# EasyEDA schematic P2000Cartridge-schem.json
TITLE: P2000 Multi ROM Cartridge; REV: 1.0; Date: 2026-02-09; Sheet: 1/1; Drawn By: Maarten Pennings; Company: Erix Collectables
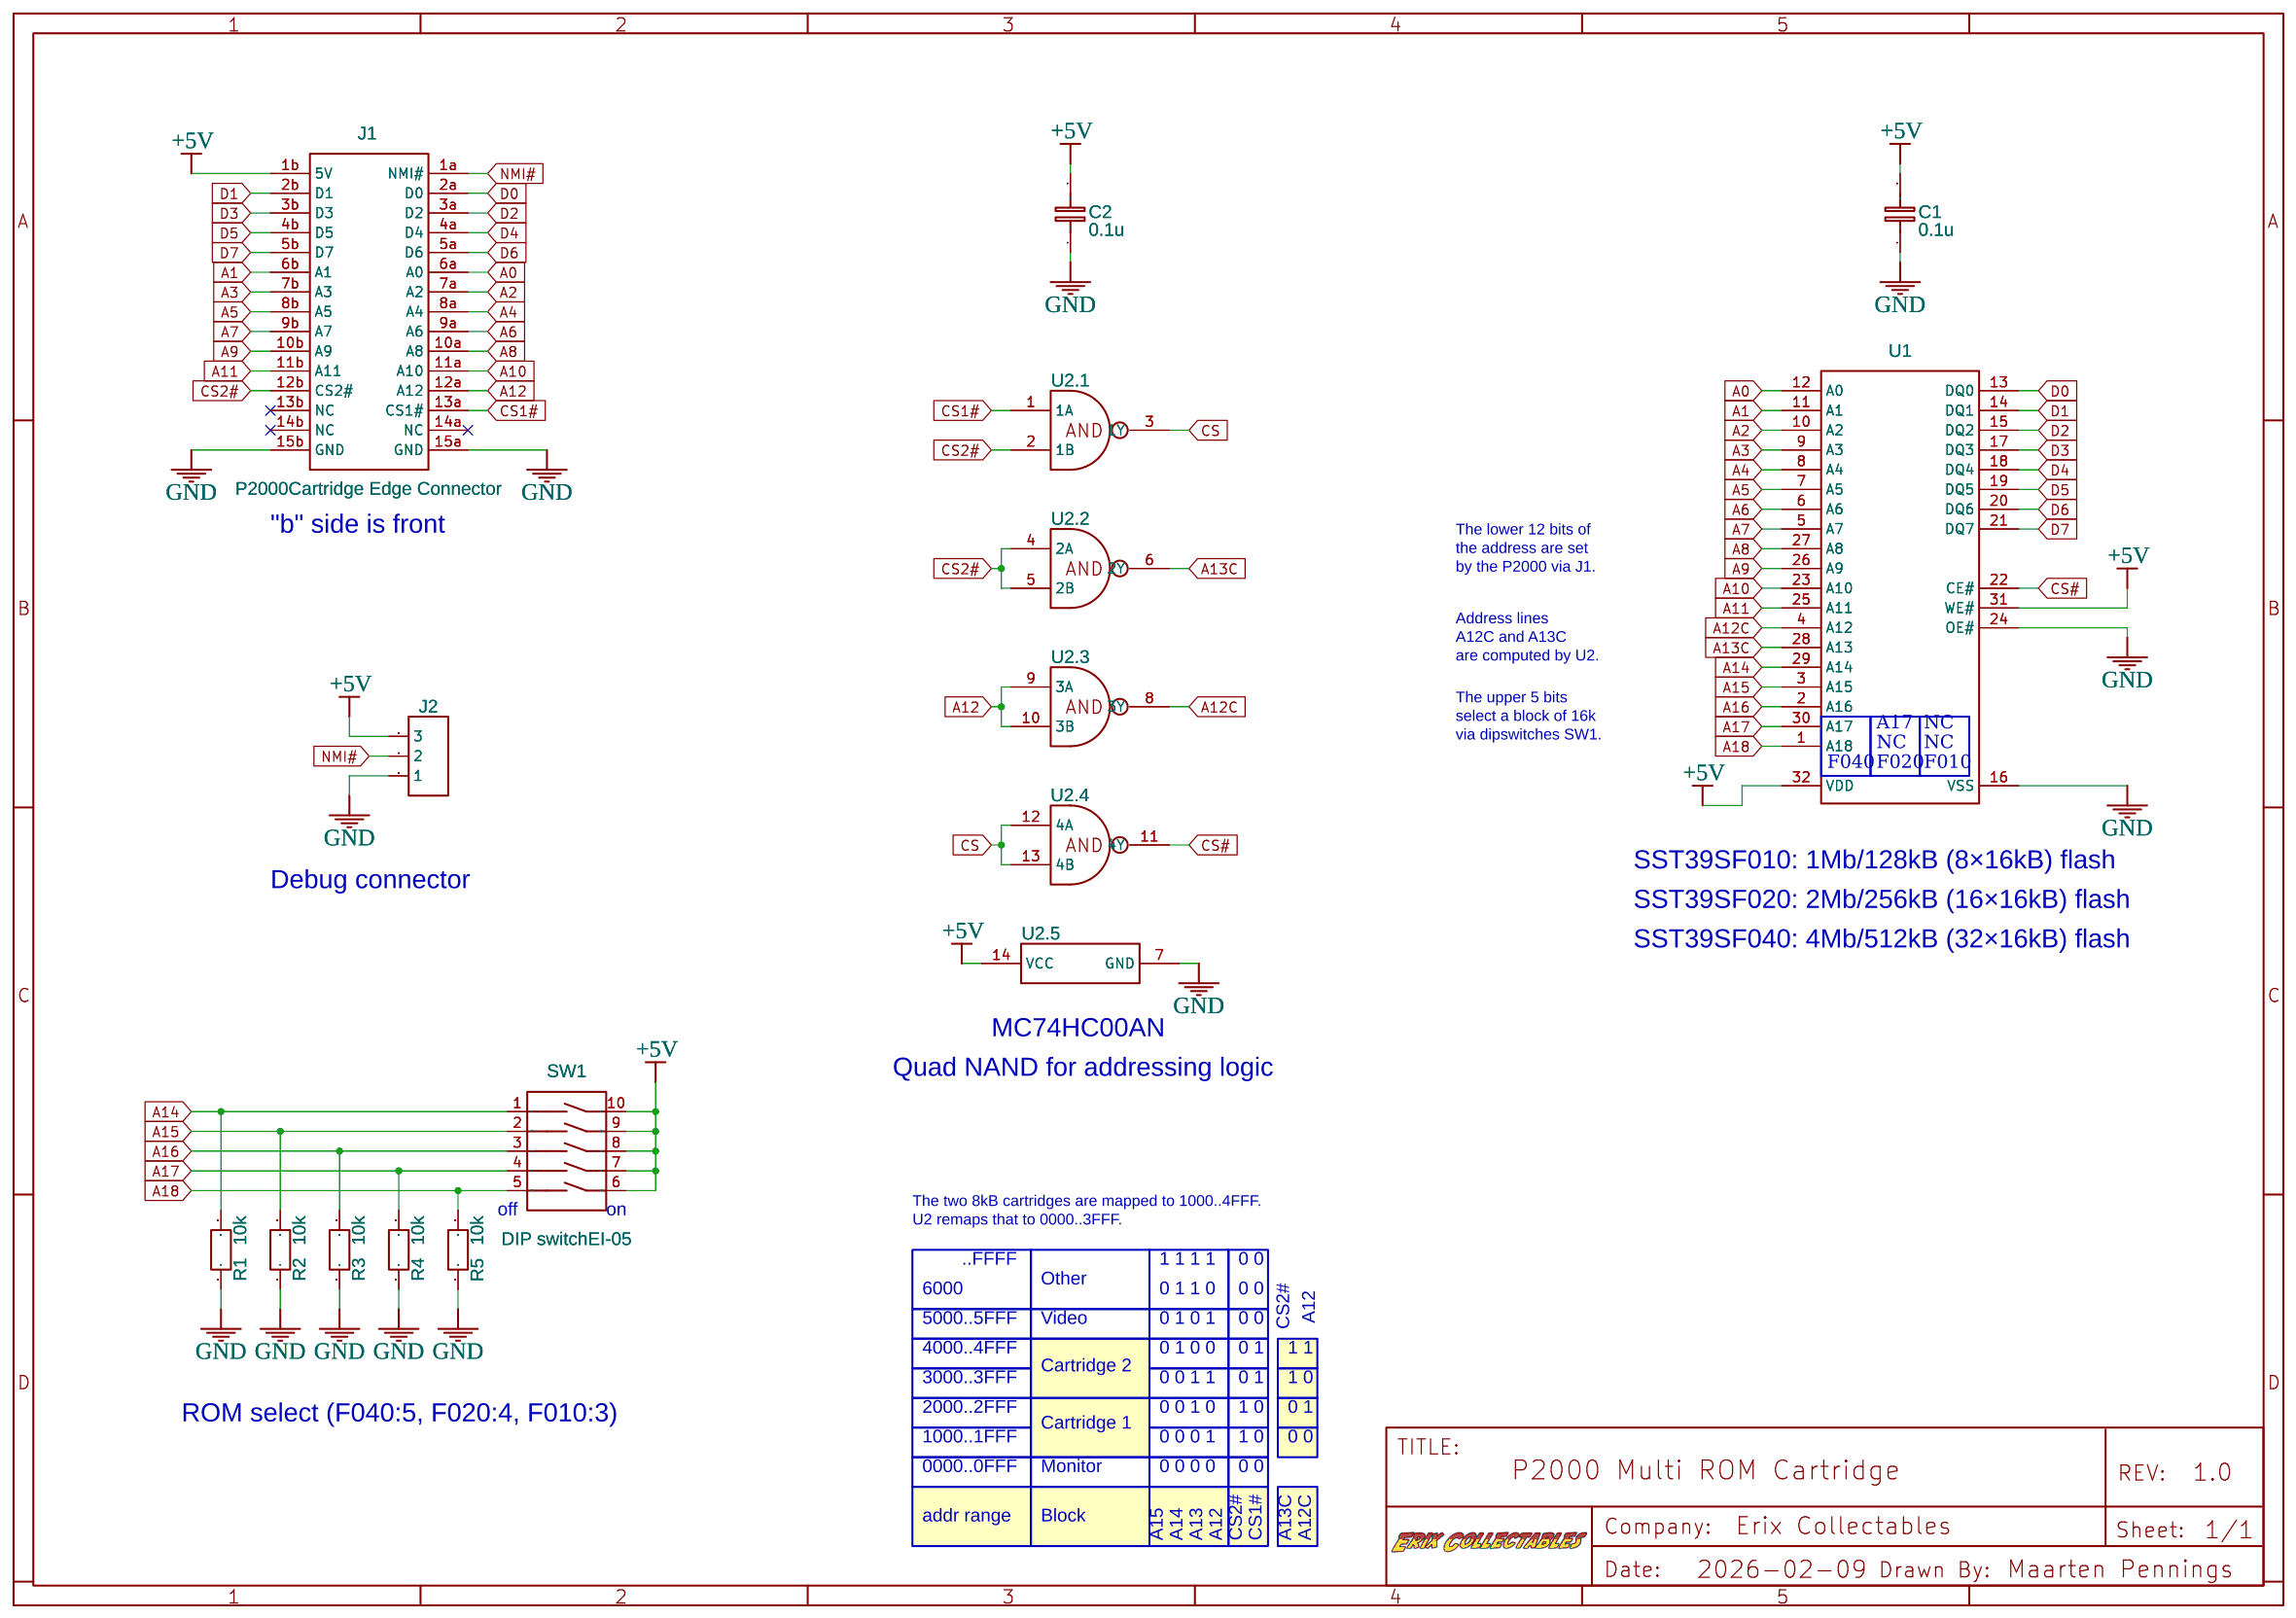
[diagram p0: schematic sheet]

## Parts
C1  0.1u  [RAD-0.1]
C2  0.1u  [RAD-0.1]
J1  P2000Cartridge Edge Connector  [P2000 CARTRIDGE EDGE CONNECTOR]
J2  HDR-M-2.54_1x3  [HDR-M-2.54_1X3]
R1  10k  [R_AXIAL-0.4]
R2  10k  [R_AXIAL-0.4]
R3  10k  [R_AXIAL-0.4]
R4  10k  [R_AXIAL-0.4]
R5  10k  [R_AXIAL-0.4]
SW1  DIP switchEI-05  [SW-TH_DIPSWITCHEI-05]
U1  SST39SF040-70-4C-PHE  [PLCC-32_L20.6-W18.0-P2.54_SOCKET]
U2  NAND-gate  [DIP14]  (sections 1,2,3,4,5)

## Library data of the parts
C1 C2 = C_RAD-0.3_EU: Contributor: LCEDA_Lib
J1 = P2000Cartridge Edge Connector: Contributor: maartenpennings
J2 = HDR-M-2.54_1x3: Supplier Part: C180248; Supplier: LCSC; Contributor: LCEDA_Lib
R1-R5 = R_AXIAL-1.0_EU: Contributor: LCEDA_Lib
SW1 = DIP switchEI-05: Supplier: Digi-Key; Manufacturer: Omron圜达; Manufacturer Part: 拨码开关EI-04; Supplier Part: Z8470-ND; JLCPCB Part Class: Extended Part; Contributor: Jeffrey Schmidt
U1 = SST39SF040-70-4C-PHE: 4 Mbit Multi-Purpose Flash, 4.5 to 5.5 V, 1 kHz, 0 to 70 degC, 32-pin PDIP (PH32), Tube; Contributor: paia
U2 = NAND-gate: Contributor: Maarten Pennings; subpart_no: 1

## Nets
+5V: C1.2 C2.2 J1.1b(5V) J2.3 SW1.6 SW1.7 SW1.8 SW1.9 SW1.10 U1.31(WE#) U1.32(VDD) U2.14(VCC)
GND: C1.1 C2.1 J1.15a(GND) J1.15b(GND) J2.1 R1.1 R2.1 R3.1 R4.1 R5.1 U1.16(VSS) U1.24(OE#) U2.7(GND)
A0: J1.6a(A0) U1.12(A0)
A1: J1.6b(A1) U1.11(A1)
A2: J1.7a(A2) U1.10(A2)
A3: J1.7b(A3) U1.9(A3)
A4: J1.8a(A4) U1.8(A4)
A5: J1.8b(A5) U1.7(A5)
A6: J1.9a(A6) U1.6(A6)
A7: J1.9b(A7) U1.5(A7)
A8: J1.10a(A8) U1.27(A8)
A9: J1.10b(A9) U1.26(A9)
A10: J1.11a(A10) U1.23(A10)
A11: J1.11b(A11) U1.25(A11)
A12: J1.12a(A12) U2.9(3A) U2.10(3B)
A12C: U1.4(A12) U2.8(3Y)
A13C: U1.28(A13) U2.6(2Y)
A14: R1.2 SW1.1 U1.29(A14)
A15: R2.2 SW1.2 U1.3(A15)
A16: R3.2 SW1.3 U1.2(A16)
A17: R4.2 SW1.4 U1.30(A17)
A18: R5.2 SW1.5 U1.1(A18)
CS: U2.3(1Y) U2.12(4A) U2.13(4B)
CS1#: J1.13a(CS1#) U2.1(1A)
CS2#: J1.12b(CS2#) U2.2(1B) U2.4(2A) U2.5(2B)
CS#: U1.22(CE#) U2.11(4Y)
D0: J1.2a(D0) U1.13(DQ0)
D1: J1.2b(D1) U1.14(DQ1)
D2: J1.3a(D2) U1.15(DQ2)
D3: J1.3b(D3) U1.17(DQ3)
D4: J1.4a(D4) U1.18(DQ4)
D5: J1.4b(D5) U1.19(DQ5)
D6: J1.5a(D6) U1.20(DQ6)
D7: J1.5b(D7) U1.21(DQ7)
NMI#: J1.1a(NMI#) J2.2

Not connected (* = marked no-connect by the designer): J1 13b(NC)* 14a(NC)* 14b(NC)*

## Notes on the sheet
- "b" side is front
- The lower 12 bits of
  the address are set
  by the P2000 via J1.
- Address lines
  A12C and A13C
  are computed by U2.
- The upper 5 bits
  select a block of 16k
  via dipswitches SW1.
- A17
- NC
- NC
- NC
- F040
- F020
- F010
- SST39SF010: 1Mb/128kB (8×16kB) flash
- Debug connector
- SST39SF020: 2Mb/256kB (16×16kB) flash
- SST39SF040: 4Mb/512kB (32×16kB) flash
- MC74HC00AN
- Quad NAND for addressing logic
- off
- on
- The two 8kB cartridges are mapped to 1000..4FFF.
  U2 remaps that to 0000..3FFF.
- ..FFFF
- 1 1 1 1
- 0 0
- 6000
- Other
- 0 1 1 0
- 0 0
- 5000..5FFF
- Video
- 0 1 0 1
- 0 0
- CS2#
- A12
- 4000..4FFF
- 0 1 0 0
- 0 1
- 1 1
- 3000..3FFF
- Cartridge 2
- 0 0 1 1
- 0 1
- 1 0
- ROM select (F040:5, F020:4, F010:3)
- 2000..2FFF
- Cartridge 1
- 0 0 1 0
- 1 0
- 0 1
- 1000..1FFF
- 0 0 0 1
- 1 0
- 0 0
- 0000..0FFF
- Monitor
- 0 0 0 0
- 0 0
- addr range
- Block
- A15
- A14
- A13
- A12
- CS2#
- CS1#
- A13C
- A12C
